# EAGLE design CAN_board (EAGLE 7.2.0)
DESCRIPTION: microOBD 200 OBD-II Module; HW_REV: 1.4; PCB_REV: C; PCB_SPEC1: Layer Count: 4; PCB_SPEC2: Size: 1.3" x 0.59"; PCB_SPEC3: Finish Thickness: 0.049" - 0.052"; PCB_SPEC4: Copper Weight: 1oz; TITLE: STM1120
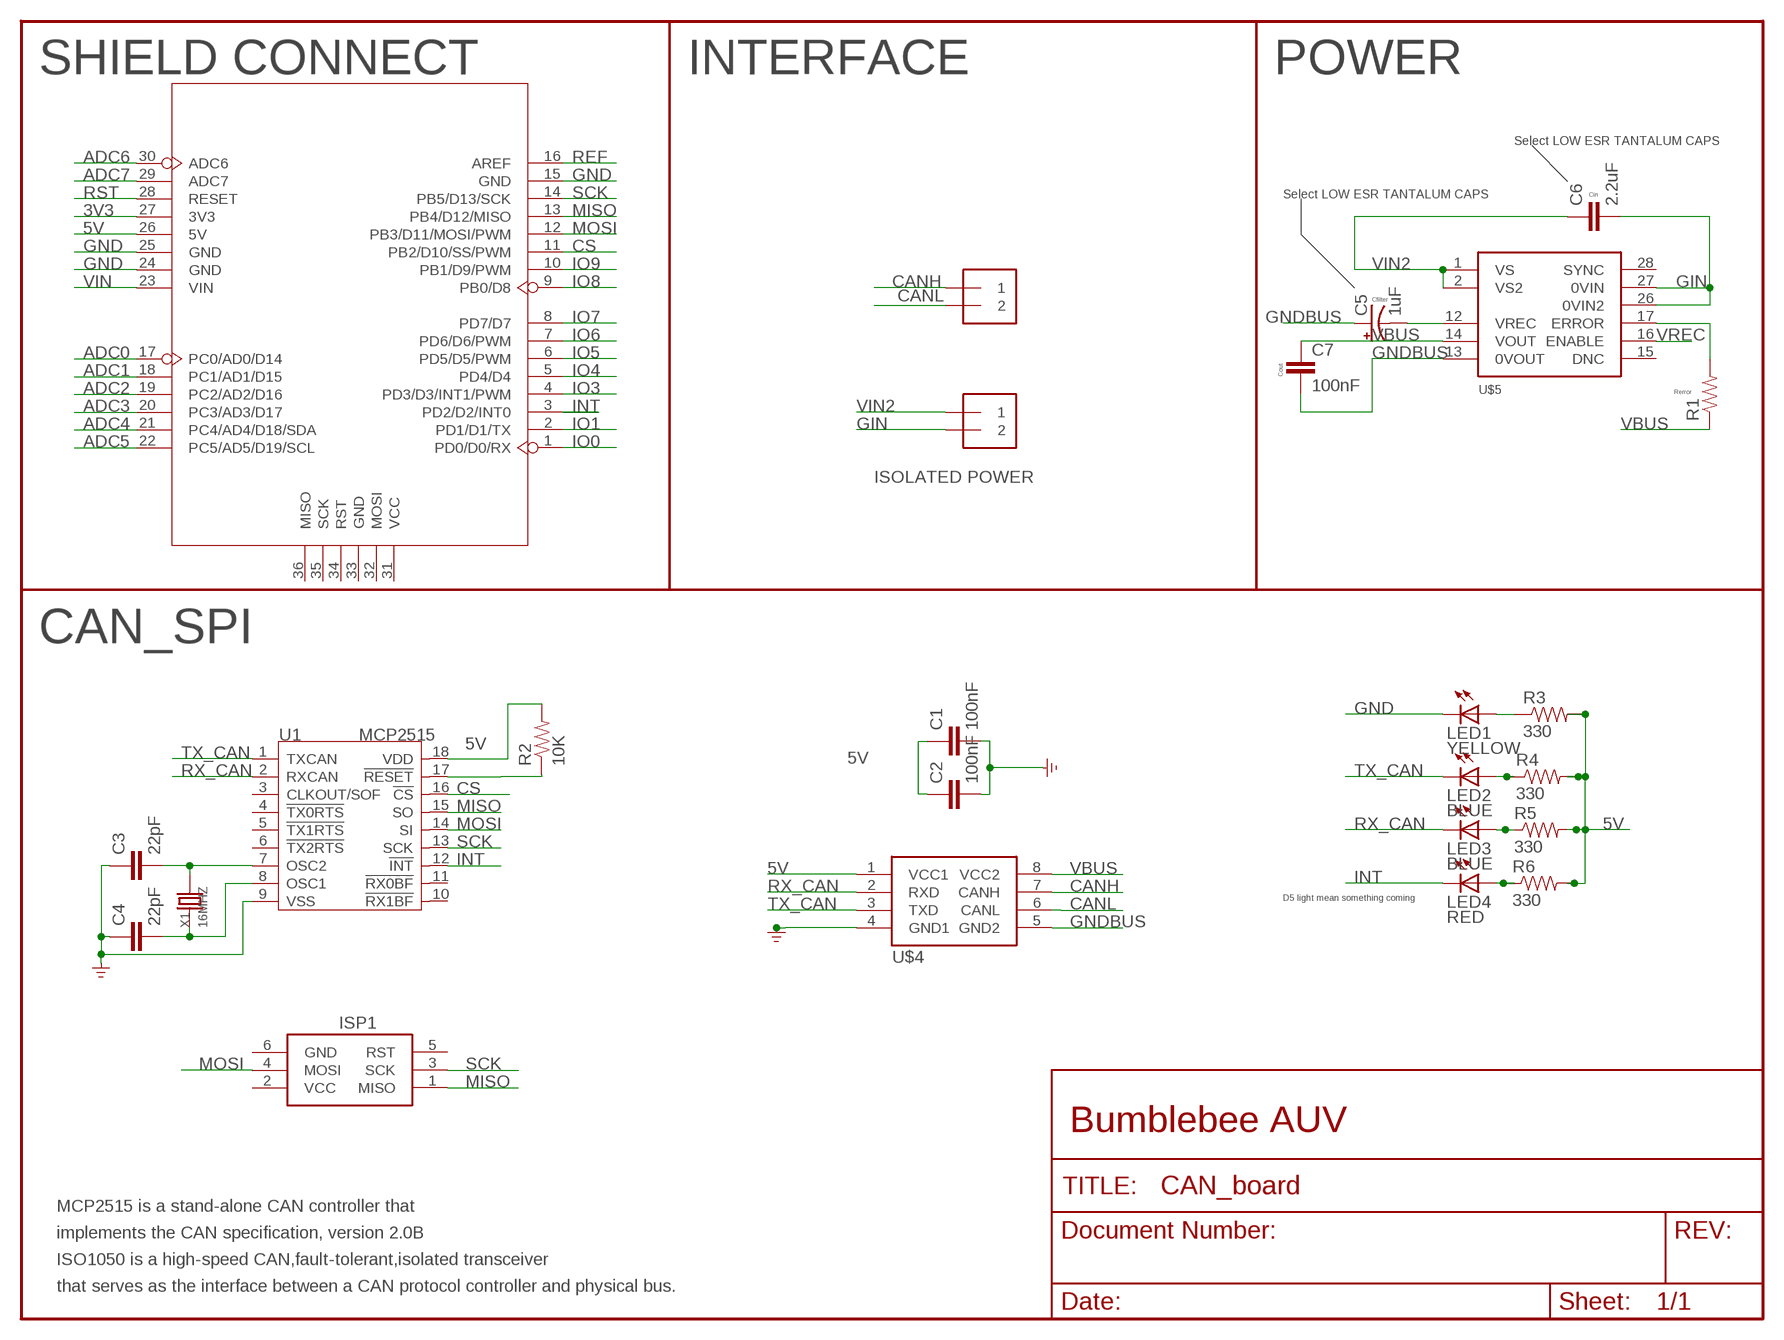
[diagram p0: schematic, sheet 1]

## Parts
C1  100nF  1UF-25V-10%(0805)  [0805]
C2  100nF  1UF-25V-10%(0805)  [0805]
C3  22pF  1UF-25V-10%(0805)  [0805]
C4  22pF  1UF-25V-10%(0805)  [0805]
C5  1uF  CAP_POL6032  [EIA6032]
C6  2.2uF  CAP0603-CAP  [0603-CAP]
C7  100nF  1UF-25V-10%(0805)  [0805]
ISP1  AVRISP-6  [AVRISP]
J0  1X2-3.5MM  [1X2-3.5MM]
J1  1X2-3.5MM  [1X2-3.5MM]
LED1  YELLOW  LEDCHIPLED_0805  [CHIPLED_0805]
LED2  BLUE  LEDCHIPLED_0805  [CHIPLED_0805]
LED3  BLUE  LEDCHIPLED_0805  [CHIPLED_0805]
LED4  RED  LEDCHIPLED_0805  [CHIPLED_0805]
R1  RESISTOR0805-RES  [0805]
R2  10K  RESISTOR0805-RES  [0805]
R3  330  RESISTOR0805-RES  [0805]
R4  330  RESISTOR0805-RES  [0805]
R5  330  RESISTOR0805-RES  [0805]
R6  330  RESISTOR0805-RES  [0805]
U1  MCP2515  [SOIC18]
U3  ARDUINO  [ARDUINO]
U$4  ISO1050  [DUB-8]
U$5  DCR01SO  [DCR01-SOIC28]
X1  16MHZ  CRYSTAL  [HC49US]

## Nets
3V3: U3.27(3V3)
5V: C1.1 C2.1 R2.2 R3.2 R4.2 R5.2 R6.2 U1.18(VDD) U3.26(5V) U$4.1(VCC1)
ADC0: U3.17(PC0/AD0/D14)
ADC1: U3.18(PC1/AD1/D15)
ADC2: U3.19(PC2/AD2/D16)
ADC3: U3.20(PC3/AD3/D17)
ADC4: U3.21(PC4/AD4/D18/SDA)
ADC5: U3.22(PC5/AD5/D19/SCL)
ADC6: U3.30(ADC6)
ADC7: U3.29(ADC7)
CANH: J0.1 U$4.7(CANH)
CANL: J0.2 U$4.6(CANL)
CS: U1.16(!CS) U3.11(PB2/D10/SS/PWM)
ERROR: R1.2 U$5.17(ERROR)
GIN: C6.2 J1.2 U$5.26(0VIN2) U$5.27(0VIN)
GND: C1.2 C2.2 C3.1 C4.1 LED1.C U1.9(VSS) U3.15(GND) U3.24(GND) U3.25(GND) U$4.4(GND1)
GNDBUS: C5.P$1(+) C7.2 U$4.5(GND2) U$5.13(0VOUT)
INT: LED4.C U1.12(!INT) U3.3(PD2/D2/INT0)
IO0: U3.1(PD0/D0/RX)
IO1: U3.2(PD1/D1/TX)
IO3: U3.4(PD3/D3/INT1/PWM)
IO4: U3.5(PD4/D4)
IO5: U3.6(PD5/D5/PWM)
IO6: U3.7(PD6/D6/PWM)
IO7: U3.8(PD7/D7)
IO8: U3.9(PB0/D8)
IO9: U3.10(PB1/D9/PWM)
MISO: ISP1.1(MISO) U1.15(SO) U3.13(PB4/D12/MISO)
MOSI: ISP1.4(MOSI) U1.14(SI) U3.12(PB3/D11/MOSI/PWM)
N$1: LED1.A R3.1
N$2: LED2.A R4.1
N$15: LED3.A R5.1
N$16: C3.2 U1.7(OSC2) X1.2
N$17: C4.2 U1.8(OSC1) X1.1
N$19: LED4.A R6.1
REF: U3.16(AREF)
RST: U3.28(RESET)
RST_N: R2.1 U1.17(!RESET)
RX_CAN: LED3.C U1.2(RXCAN) U$4.2(RXD)
SCK: ISP1.3(SCK) U1.13(SCK) U3.14(PB5/D13/SCK)
TX_CAN: LED2.C U1.1(TXCAN) U$4.3(TXD)
VBUS: C7.1 R1.1 U$4.8(VCC2) U$5.14(VOUT)
VIN: U3.23(VIN)
VIN2: C6.1 J1.1 U$5.1(VS) U$5.2(VS2)
VREC: C5.P$2(-) U$5.12(VREC) U$5.16(ENABLE)
Unconnected: ISP1.5(RST) U1.3(CLKOUT/SOF) U1.4(!TX0RTS) U1.5(!TX1RTS) U1.6(!TX2RTS) U1.10(!RX1BF) U1.11(!RX0BF) U3.31(VCC) U3.32(MOSI) U3.33(GND) U3.34(RST) U3.35(SCK) U3.36(MISO) U$5.15(DNC) U$5.28(SYNC)

## Notes on the sheet
- SHIELD CONNECT | INTERFACE | POWER
- Select LOW ESR TANTALUM CAPS
- Cin
- Select LOW ESR TANTALUM CAPS
- Cfilter
- Cout
- Rerror
- ISOLATED POWER
- CAN_SPI
- D5 light mean something coming
- Bumblebee AUV
- MCP2515 is a stand-alone CAN controller that
- implements the CAN specification, version 2.0B
- ISO1050 is a high-speed CAN,fault-tolerant,isolated transceiver
- that serves as the interface between a CAN protocol controller and physical bus.

## Power pins joined to a net without a drawn wire
GND: ISP1.6(GND)
VCC: ISP1.2(VCC)

## Library data of the parts
C1 C2 C7 = SparkFun-Capacitors:1UF-25V-10%(0805): CAP-08064; MPN: MC0805B104K250CT; OC_NEWARK: 06R3740; PROD_ID: CAP-08064; VALUE: 1uF
C3 C4 = SparkFun-Capacitors:1UF-25V-10%(0805): CAP-08064; MPN: MC0603N220K500CT; OC_NEWARK: 06R5152; PROD_ID: CAP-08064; VALUE: 1uF
C5 = SparkFun-Passives:CAP_POL: Capacitor Polarized These are standard SMD and PTH capacitors. Normally 10uF, 47uF, and 100uF in electrolytic and tantalum varieties. Always verify the external diameter of the through hole cap, it varies with capacity, voltage, and manufacturer. The EIA devices should be standard.; MPN: TR3C105K050C1600; OC_NEWARK: 08X2165
C6 = SparkFun-Passives:CAP: Capacitor Standard 0603 ceramic capacitor, and 0.1" leaded capacitor.; MPN: F381A225MMA; OC_NEWARK: 04X6289
ISP1 = adafruit:AVRISP: AVR ISP HEADER Standard 6 pin header for AVR programming; OC_NEWARK: unknown
J0 J1 = adafruit:1X2: 3.5mm Terminal block http://www.ladyada.net/library/pcb/eaglelibrary.html; OC_NEWARK: unknown
LED1 = adafruit:LED: LED OSRAM: - CHIPLED LG R971, LG N971, LY N971, LG Q971, LY Q971, LO R971, LY R971 LH N974, LH R974 LS Q976, LO Q976, LY Q976 LO Q996 - Hyper CHIPLED LW Q18S LB Q993, LB Q99A, LB R99A - SideLED LS A670, LO A670, LY A670, LG A670, LP A670 LB A673, LV A673, LT A673, LW A673 LH A674 LY A675 LS A676, LA A676, LO A676, LY A676, LW A676 LS A679, LY A679, LG A679 - Hyper Micro SIDELED® LS Y876, LA Y876, LO Y876, LY Y876 LT Y87S - SmartLED LW L88C, LW L88S LB L89C, LB L89S, LG L890 LS L89K, LO L89K, LY L89K LS L896, LA L896, LO L896, LY L896 - TOPLED LS T670, LO T670, LY T670, LG T670, LP T670 LSG T670, LSP T670, LSY T670, LOP T670, LYG T670 LG T671, LOG T671, LSG T671 LB T673, LV T673, LT T673, LW T673 LH T674 LS T676, LA T676, LO T676, LY T676, LB T676, LH T676, LSB T676, LW T676 LB T67C, LV T67C, LT T67C, LS T67K, LO T67K, LY T67K, LW E67C LS E67B, LA E67B, LO E67B, LY E67B, LB E67C, LV E67C, LT E67C LW T67C LS T679, LY T679, LG T679 LS T770, LO T770, LY T770, LG T770, LP T770 LB T773, LV T773, LT T773, LW T773 LH T774 LS E675, LA E675, LY E675, LS T675 LS T776, LA T776, LO T776, LY T776, LB T776 LHGB T686 LT T68C, LB T68C - Hyper Mini TOPLED® LB M676 - Mini TOPLED Santana® LG M470 LS M47K, LO M47K, LY M47K Source: http://www.osram.convergy.de/; MPN: KPT-2012SYCK-J3; OC_NEWARK: 96W6961
LED2 LED3 = adafruit:LED: LED OSRAM: - CHIPLED LG R971, LG N971, LY N971, LG Q971, LY Q971, LO R971, LY R971 LH N974, LH R974 LS Q976, LO Q976, LY Q976 LO Q996 - Hyper CHIPLED LW Q18S LB Q993, LB Q99A, LB R99A - SideLED LS A670, LO A670, LY A670, LG A670, LP A670 LB A673, LV A673, LT A673, LW A673 LH A674 LY A675 LS A676, LA A676, LO A676, LY A676, LW A676 LS A679, LY A679, LG A679 - Hyper Micro SIDELED® LS Y876, LA Y876, LO Y876, LY Y876 LT Y87S - SmartLED LW L88C, LW L88S LB L89C, LB L89S, LG L890 LS L89K, LO L89K, LY L89K LS L896, LA L896, LO L896, LY L896 - TOPLED LS T670, LO T670, LY T670, LG T670, LP T670 LSG T670, LSP T670, LSY T670, LOP T670, LYG T670 LG T671, LOG T671, LSG T671 LB T673, LV T673, LT T673, LW T673 LH T674 LS T676, LA T676, LO T676, LY T676, LB T676, LH T676, LSB T676, LW T676 LB T67C, LV T67C, LT T67C, LS T67K, LO T67K, LY T67K, LW E67C LS E67B, LA E67B, LO E67B, LY E67B, LB E67C, LV E67C, LT E67C LW T67C LS T679, LY T679, LG T679 LS T770, LO T770, LY T770, LG T770, LP T770 LB T773, LV T773, LT T773, LW T773 LH T774 LS E675, LA E675, LY E675, LS T675 LS T776, LA T776, LO T776, LY T776, LB T776 LHGB T686 LT T68C, LB T68C - Hyper Mini TOPLED® LB M676 - Mini TOPLED Santana® LG M470 LS M47K, LO M47K, LY M47K Source: http://www.osram.convergy.de/; MPN: 150080BS75000; OC_NEWARK: 95W3799
LED4 = adafruit:LED: LED OSRAM: - CHIPLED LG R971, LG N971, LY N971, LG Q971, LY Q971, LO R971, LY R971 LH N974, LH R974 LS Q976, LO Q976, LY Q976 LO Q996 - Hyper CHIPLED LW Q18S LB Q993, LB Q99A, LB R99A - SideLED LS A670, LO A670, LY A670, LG A670, LP A670 LB A673, LV A673, LT A673, LW A673 LH A674 LY A675 LS A676, LA A676, LO A676, LY A676, LW A676 LS A679, LY A679, LG A679 - Hyper Micro SIDELED® LS Y876, LA Y876, LO Y876, LY Y876 LT Y87S - SmartLED LW L88C, LW L88S LB L89C, LB L89S, LG L890 LS L89K, LO L89K, LY L89K LS L896, LA L896, LO L896, LY L896 - TOPLED LS T670, LO T670, LY T670, LG T670, LP T670 LSG T670, LSP T670, LSY T670, LOP T670, LYG T670 LG T671, LOG T671, LSG T671 LB T673, LV T673, LT T673, LW T673 LH T674 LS T676, LA T676, LO T676, LY T676, LB T676, LH T676, LSB T676, LW T676 LB T67C, LV T67C, LT T67C, LS T67K, LO T67K, LY T67K, LW E67C LS E67B, LA E67B, LO E67B, LY E67B, LB E67C, LV E67C, LT E67C LW T67C LS T679, LY T679, LG T679 LS T770, LO T770, LY T770, LG T770, LP T770 LB T773, LV T773, LT T773, LW T773 LH T774 LS E675, LA E675, LY E675, LS T675 LS T776, LA T776, LO T776, LY T776, LB T776 LHGB T686 LT T68C, LB T68C - Hyper Mini TOPLED® LB M676 - Mini TOPLED Santana® LG M470 LS M47K, LO M47K, LY M47K Source: http://www.osram.convergy.de/; MPN: KPT-2012SRC-J4; OC_NEWARK: 88W4951
R1 = SparkFun-Passives:RESISTOR: Resistor Basic schematic elements and footprints for 0603, 1206, and PTH resistors.; OC_NEWARK: unknown
R2 = SparkFun-Passives:RESISTOR: Resistor Basic schematic elements and footprints for 0603, 1206, and PTH resistors.; MF: VISHAY/DALE; MPN: CRCW080510K0FKTA; OC_NEWARK: 05F1511
R3-R6 = SparkFun-Resistors:RESISTOR: Resistor Basic schematic elements and footprints for 0603, 1206, and PTH resistors.; MPN: MCHP05W4F3300T5E; OC_NEWARK: 01N7024
U1 = IC:MCP2515: Stand-Alone CAN Controller With SPI Interface; MF: MICROCHIP; MPN: MCP2515-I/SO; OC_NEWARK: 29H7136
U3 = Module:ARDUINO; OC_NEWARK: unknown
U$4 = bbauv:ISO1050: The ISO1050 is a galvanically isolated CAN transceiver that meets the specifications of the ISO11898-2 standard. The device has the logic input and output buffers separated by a silicon oxide (SiO2) insulation barrier that provides galvanic isolation of up to 5000 VRMS for ISO1050DW and 2500 VRMS for ISO1050DUB. Used in conjunction with isolated power supplies, the device prevents noise currents on a data bus or other circuits from entering the local ground and interfering with or damaging sensitive circuitry. As a CAN transceiver, the device provides differential transmit capability to the bus and differential receive capability to a CAN controller at signaling rates up to 1 megabit per second (Mbps). Designed for operation in especially harsh environments, the device features cross-wire, overvoltage and loss of ground protection from –27 V to 40 V and over-temperature shut-down, as well as –12 V to 12 V common-mode range. The ISO1050 is characterized for operation over the ambient temperature range of –55°C to 105°C.; MPN: ISO1050DUBR; OC_NEWARK: 14R9899
U$5 = bbauv:DCR01: The DCR01 family is a series of high-efficiency, input-isolated, output-regulated DC/DC converters. In addition to 1W nominal, galvanically-isolated output power capability, this range of DC/DCs offer very low output noise, thermal protection, and high accuracy. The DCR01 family is implemented in standard molded IC packaging, giving standard JEDEC outlines suitable for high-volume assembly. The DCR01 is manufactured using the same technology as standard IC packages, thereby achieving very high reliability.; MF: TEXAS INSTRUMENTS; MPN: DCR010505U; OC_NEWARK: 84K1268
X1 = Discrete:CRYSTAL*; MF: CITIZEN AMERICA, CORPORATION; MPN: HC-49/U-S16000000ABJB; OC_NEWARK: 59K8183

## Net classes
0 default: width 0.203 mm, drill 0.305 mm, clearance 0.203 mm

## Board
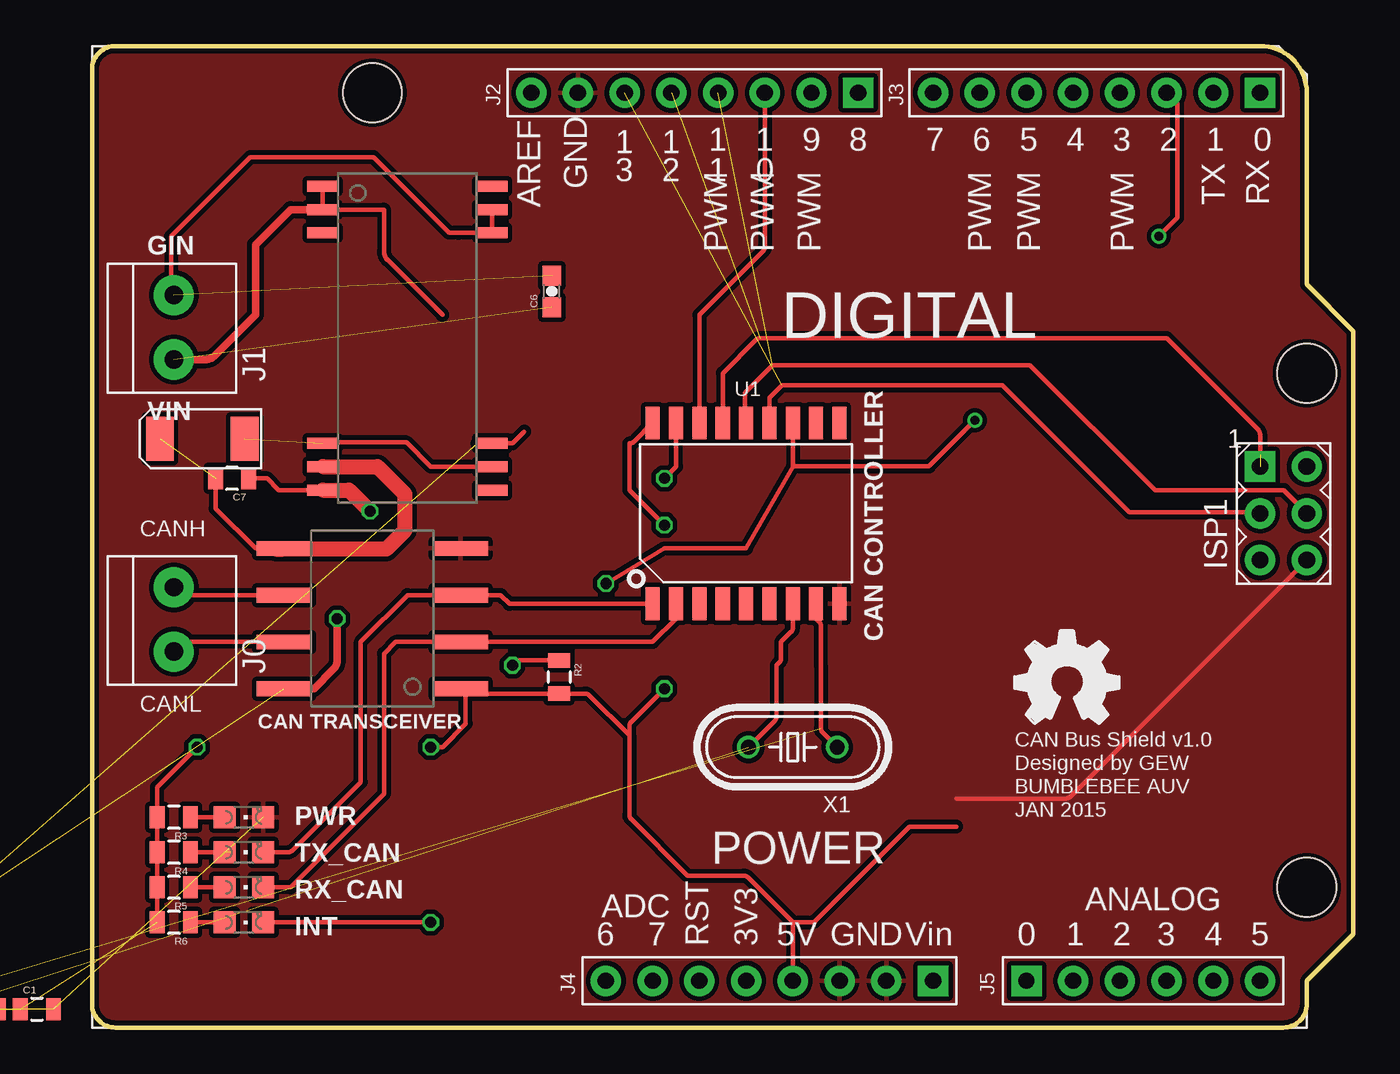
[diagram p1: board, top side]
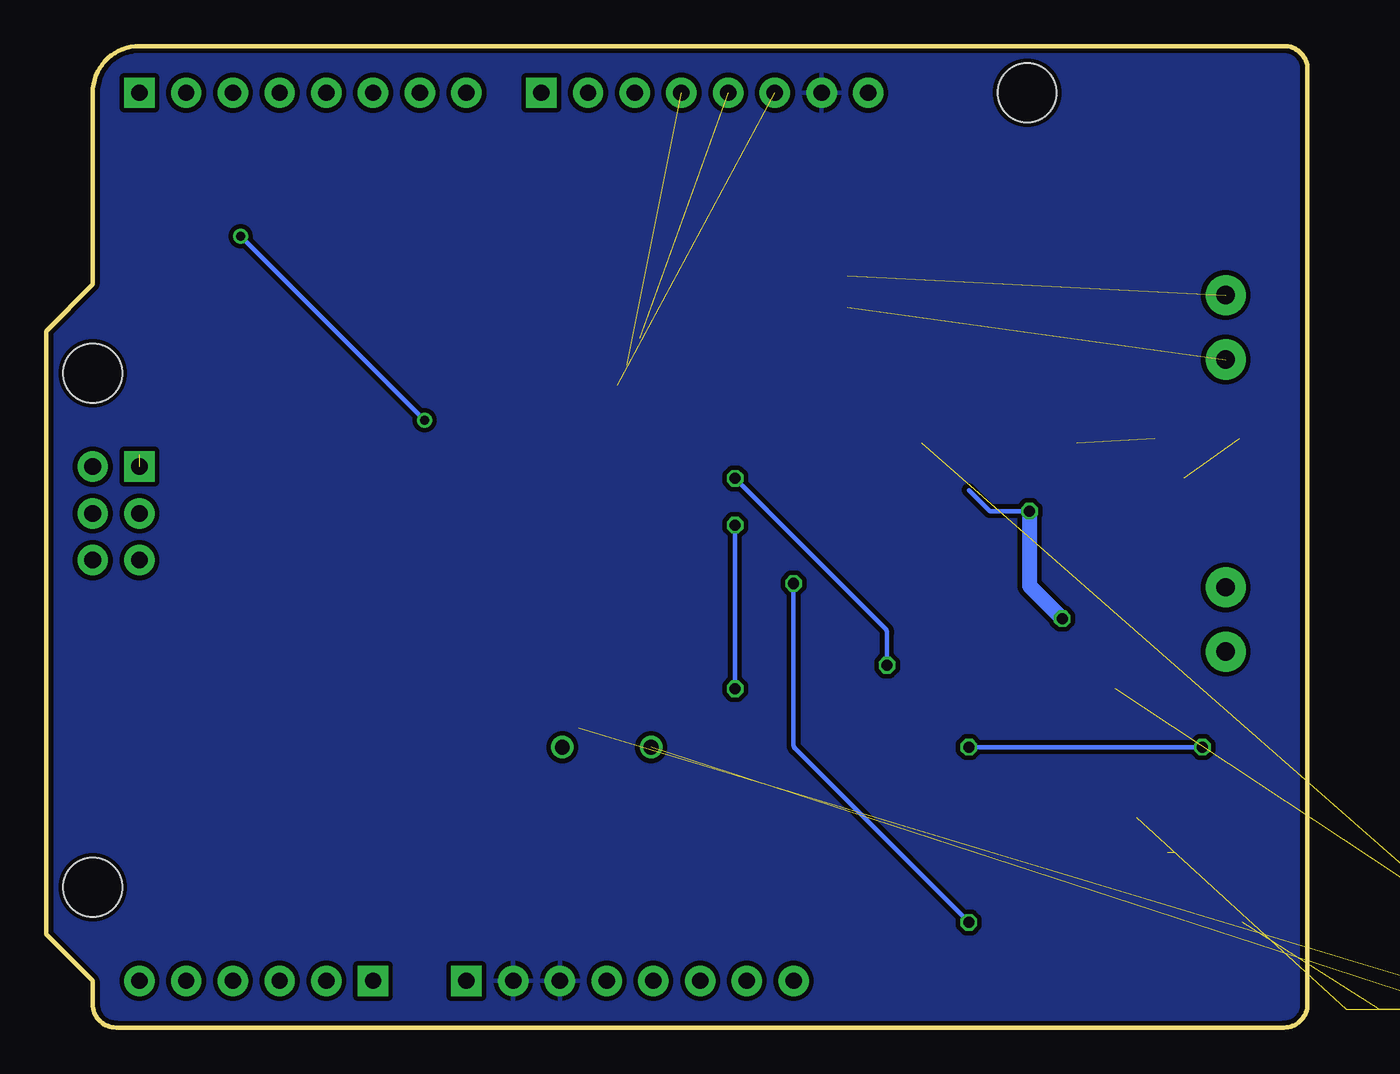
[diagram p2: board, bottom side, seen from below]

Size 68.58 x 53.34 mm. Coordinates in mm from the lower left corner, seen from the top.
Outline: 66.04,2.54 66.04,1.27 arc-90 64.77,0 1.27,0 arc-90 0,1.27 0,52.07 arc-90 1.27,53.34 63.5,53.34 arc-90 66.04,50.8 66.04,40.39 68.58,37.85 68.58,5.08 66.04,2.54
Copper layers (1*2*15*16): Top 0.035mm / dielectric 0.2mm / Route2 0.0175mm / dielectric 1.1mm / Route15 0.0175mm / dielectric 0.2mm / Bottom 0.035mm
Design rules "SeeedStudio_DRU_no_angle_20130527": minimum track width 6mil, minimum drill 12mil, track to track 6mil, track to pad 6mil, pad to pad 6mil, via to via 6mil, smd to smd 0mil, copper to edge 10mil, drill to drill 10mil, minimum pad ring 6mil, minimum via ring 6mil, stop-mask expansion 2mil, vias tented up to drill 25mil, thermal gap 10mil

### Footprints (pad centres in the part's own frame; a part is rotated, then mirrored left to right if it is on the bottom)
0805 = smd 0.8 x 1.2: 1 -0.9,0; 2 0.9,0
EIA6032 = smd 1.5 x 2.4: P$1 -2.3,0; P$2 2.3,0
0603-CAP = smd 1.1 x 1: 1 -0.85,0; 2 0.85,0
AVRISP = drill 0.9 pad 1.626: 1 -1.27,2.54; 2 1.27,2.54; 3 -1.27,0; 4 1.27,0; 5 -1.27,-2.54; 6 1.27,-2.54
1X2-3.5MM = drill 1 pad 2.184: 1 1.8,0; 2 -1.7,0
CHIPLED_0805 = smd 1.2 x 1.2: A 0,-1.05; C 0,1.05
SOIC18 = smd 0.762 x 1.778: 1 -5.08,-4.915; 2 -3.81,-4.915; 3 -2.54,-4.915; 4 -1.27,-4.915; 5 0,-4.915; 6 1.27,-4.915; 7 2.54,-4.915; 8 3.81,-4.915; 9 5.08,-4.915; 10 5.08,4.915; 11 3.81,4.915; 12 2.54,4.915; 13 1.27,4.915; 14 0,4.915; 15 -1.27,4.915; 16 -2.54,4.915; 17 -3.81,4.915; 18 -5.08,4.915
ARDUINO = drill 0.889 pad 1.651 square: 1 63.5,50.8; 9 41.656,50.8; 17 50.8,2.54; 23 45.72,2.54; 36 63.5,30.48 | drill 0.889 pad 1.651: 2 60.96,50.8; 3 58.42,50.8; 4 55.88,50.8; 5 53.34,50.8; 6 50.8,50.8; 7 48.26,50.8; 8 45.72,50.8; 10 39.116,50.8; 11 36.576,50.8; 12 34.036,50.8; 13 31.496,50.8; 14 28.956,50.8; 15 26.416,50.8; 16 23.876,50.8; 18 53.34,2.54; 19 55.88,2.54; 20 58.42,2.54; 21 60.96,2.54; 22 63.5,2.54; 24 43.18,2.54; 25 40.64,2.54; 26 38.1,2.54; 27 35.56,2.54; 28 33.02,2.54; 29 30.48,2.54; 30 27.94,2.54; 31 66.04,30.48; 32 66.04,27.94; 33 66.04,25.4; 34 63.5,25.4; 35 63.5,27.94 | hole 3.2: 15.24,50.8; 66.04,35.56; 66.04,7.62
DUB-8 = smd 0.8 x 3: 1 -3.81,-4.8; 2 -1.27,-4.8; 3 1.27,-4.8; 4 3.81,-4.8; 5 3.81,4.8; 6 1.27,4.8; 7 -1.27,4.8; 8 -3.81,4.8
DCR01-SOIC28 = smd 0.6 x 1.7: 1 -8.255,-4.6; 2 -6.985,-4.6; 3 -5.715,-4.6; 12 5.715,-4.6; 13 6.985,-4.6; 14 8.255,-4.6; 15 8.255,4.6; 16 6.985,4.6; 17 5.715,4.6; 26 -5.715,4.6; 27 -6.985,4.6; 28 -8.255,4.6; P$2 -6.985,4.6
HC49US = drill 0.813: 1 -2.413,0; 2 2.413,0

### Placement (x,y rotation side)
C1  -3,1 0 top
C2  -6,1 0 top  (outside the outline)
C3  -9,1 0 top  (outside the outline)
C4  -12,1 0 top  (outside the outline)
C5  6,32 0 top
C6  25,40 90 top
C7  7.62,29.84 180 top
ISP1  64.77,27.94 0 top
J0  4.45,22.23 270 top
J1  4.45,38.1 270 top
LED1  8.26,11.43 270 top
LED2  8.26,9.53 270 top
LED3  8.26,7.62 270 top
LED4  8.26,5.71 270 top
R1  -15,1 0 top  (outside the outline)
R2  25.4,19.05 270 top
R3  4.45,11.43 180 top
R4  4.45,9.53 180 top
R5  4.45,7.62 180 top
R6  4.45,5.71 180 top
U1  35.56,27.94 0 top
U3  0,0 0 top
U$2  [OSHW_FILLX200_NOTEXT]  50.16,16.51 0 top
U$4  15.24,22.23 90 top
U$5  17.14,37.47 270 top
X1  38.1,15.24 180 top

### Tracks (layer width: path | path; a pad name or v marks a point on that pad's centre or on a via)
5V  (via drill 0.6)  (2 unrouted)
  Top 0.254: R6.2 R5.2 R4.2 R3.2 3.54,13.07 v5.71,15.24 | v18.41,15.24 19.05,15.24 20.32,16.51 20.32,18.14 | 20.32,18.14 U$4.1 | 20.32,18.14 24.68,18.14 R2.2 26.8,18.15 | 26.8,18.15 arc-45 27.03,18.06 | 29.21,15.88 29.21,11.56 arc45 29.3,11.34 32.38,8.26 35.43,8.26 arc-45 35.65,8.16 38.1,5.71 | 38.1,5.71 U3.26 | 38.1,5.71 39.11,5.71 arc45 39.34,5.81 44.45,10.92 46.99,10.92 | 26.8,18.15 arc-45 27.03,18.06 | 27.03,18.06 29.21,15.88 | 29.21,15.88 29.21,16.38 arc-45 29.3,16.6 v31.11,18.41 | v31.11,27.3 29.21,29.21 29.21,31.75 29.24,31.75 arc45 29.47,31.84 U1.18
  Bottom 0.254: v5.71,15.24 v18.41,15.24 | v31.11,18.41 v31.11,27.3
CANH
  Top 0.254: U$4.7 4.97,20.95 J0.1
CANL
  Top 0.254: U$4.6 4.88,23.5 J0.2
CS
  Top 0.254: U3.11 36.58,42.42 arc-45 36.48,42.2 33.02,38.73 U1.16
ERROR  (1 unrouted)
  Top 0.254: 23.5,32.38 22.86,31.75 U$5.17 20.95,31.75
GIN  (1 unrouted)
  Top 0.254: U$5.27 U$5.26 | U$5.26 22.32,43.18 | U$5.26 19.92,43.18 19.9,43.2 19.4,43.2 15.3,47.3 8.6,47.3 4.3,43 4.3,39.95 J1.2
GND  (4 unrouted)
  Top 0.254: 46.99,12.45 52.95,12.45 arc45 53.18,12.54 ISP1.6
  pour Top (isolate 0.254): 0,53.34 68.58,53.34 68.58,0 0,0
  pour Bottom (isolate 0.254): 0,53.34 68.58,53.34 68.58,0 0,0
GNDBUS  (1 unrouted)
  Top 0.254: C7.2 6.72,28.2 8.89,26.04 U$4.5 10.79,26.04
  Top 0.813: U$5.13 15.52,30.48 17,29 17,27 16,26 10.4,26 | 10,26 10.4,26 | 10.4,26 U$4.5
INT  (via drill 0.51, 0.6)
  Top 0.254: 38.1,30.5 38.1,30.48 35.56,26.04 31.11,26.04 v27.94,24.13 | v18.41,5.71 LED4.C | U1.12 38.1,30.5 | 38.1,30.5 45.5,30.5 v48,33 | v58,43 59,44 59,50.22 U3.3
  Bottom 0.254: v27.94,24.13 27.94,15.37 arc-45 27.85,15.15 v18.41,5.71 | v48,33 v58,43
MISO  (2 unrouted)
  Top 0.254: U1.15 34.29,35.56 36.1,37.37 arc-45 36.33,37.47 58.42,37.47 63.41,32.48 arc-45 63.5,32.25 63.5,31.11
MOSI  (1 unrouted)
  Top 0.254: ISP1.4 66.04,27.96 64.8,29.2 57.8,29.2 51,36 37,36 35.5,34.5 35.5,32.91 U1.14
N$1
  Top 0.254: R3.1 LED1.A
N$2  (1 unrouted)
  Top 0.254: R4.1 7.62,9.53
N$15
  Top 0.254: LED3.A R5.1
N$16  (1 unrouted)
  Top 0.254: U1.7 38.1,21.72 arc-45 38.01,21.5 37.47,20.95 37.47,20.07 arc-45 37.37,19.85 37.21,19.68 37.21,16.9 arc-45 37.12,16.67 X1.2
N$17  (1 unrouted)
  Top 0.254: X1.1 39.72,16.04 arc-45 39.62,16.26 39.62,19.68 39.62,21.84 arc45 39.53,22.06 39.37,22.23 U1.8
N$19
  Top 0.254: LED4.A R6.1
RST_N  (via drill 0.6)
  Top 0.254: R2.1 23.26,19.95 arc45 23.03,19.86 v22.86,19.68 | v31.11,29.84 31.75,30.48 U1.17
  Bottom 0.254: v22.86,19.68 22.86,21.46 arc-45 22.95,21.68 v31.11,29.84
RX_CAN
  Top 0.254: LED3.C 10.79,7.62 15.88,12.7 15.88,20.32 16.51,20.95 U$4.2 30.48,20.95 31.75,22.23 U1.2
SCK  (1 unrouted)
  Top 0.254: U1.13 36.83,34.23 37.5,34.9 49.5,34.9 56.4,28 63.44,28 ISP1.3
TX_CAN
  Top 0.254: U1.1 22.7,23.02 22.23,23.5 20.32,23.5 U$4.3 17.14,23.5 14.61,20.95 14.61,13.34 10.89,9.62 arc-45 10.66,9.53 LED2.C
VBUS  (via drill 0.6)  (1 unrouted)
  Top 0.254: U$5.14 10.16,29.21 9.53,29.84 C7.1
  Top 0.406: v13.34,22.23 13.34,19.95 arc-45 13.15,19.5 12.06,18.41 U$4.8
  Top 0.813: U$5.14 13.97,29.21 v15.11,28.07
  Bottom 0.254: v15.11,28.07 17.27,28.07 18.41,29.21
  Bottom 0.813: v15.11,28.07 15.11,24 v13.34,22.23
VIN2  (1 unrouted)
  Top 0.254: U$5.1 U$5.2 15.88,44.45 15.88,42.17 arc45 16.06,41.72 19.05,38.73
  Top 0.406: J1.1 6.19,36.3 arc45 6.64,36.49 8.89,38.73 8.89,42.55 10.79,44.45 U$5.2
VREC  (1 unrouted)
  Top 0.254: U$5.16 18.42,30.48 17.1,31.8 12.6,31.8 U$5.12

### Text on the board
tPlace: J2 | J3 | GIN | VIN | CANH | CAN CONTROLLER | CANL | CAN TRANSCEIVER | CAN Bus Shield v1.0 | Designed by GEW | BUMBLEBEE AUV | PWR | JAN 2015 | TX_CAN | RX_CAN | INT | J4 | J5